# EasyEDA schematic CircuitDiagramSheet.json
TITLE: Cool Macro Keyboard; REV: 1.0; Date: 2023-12-19; Sheet: 1/1; Drawn By: Ben Zhou; Company: Idk
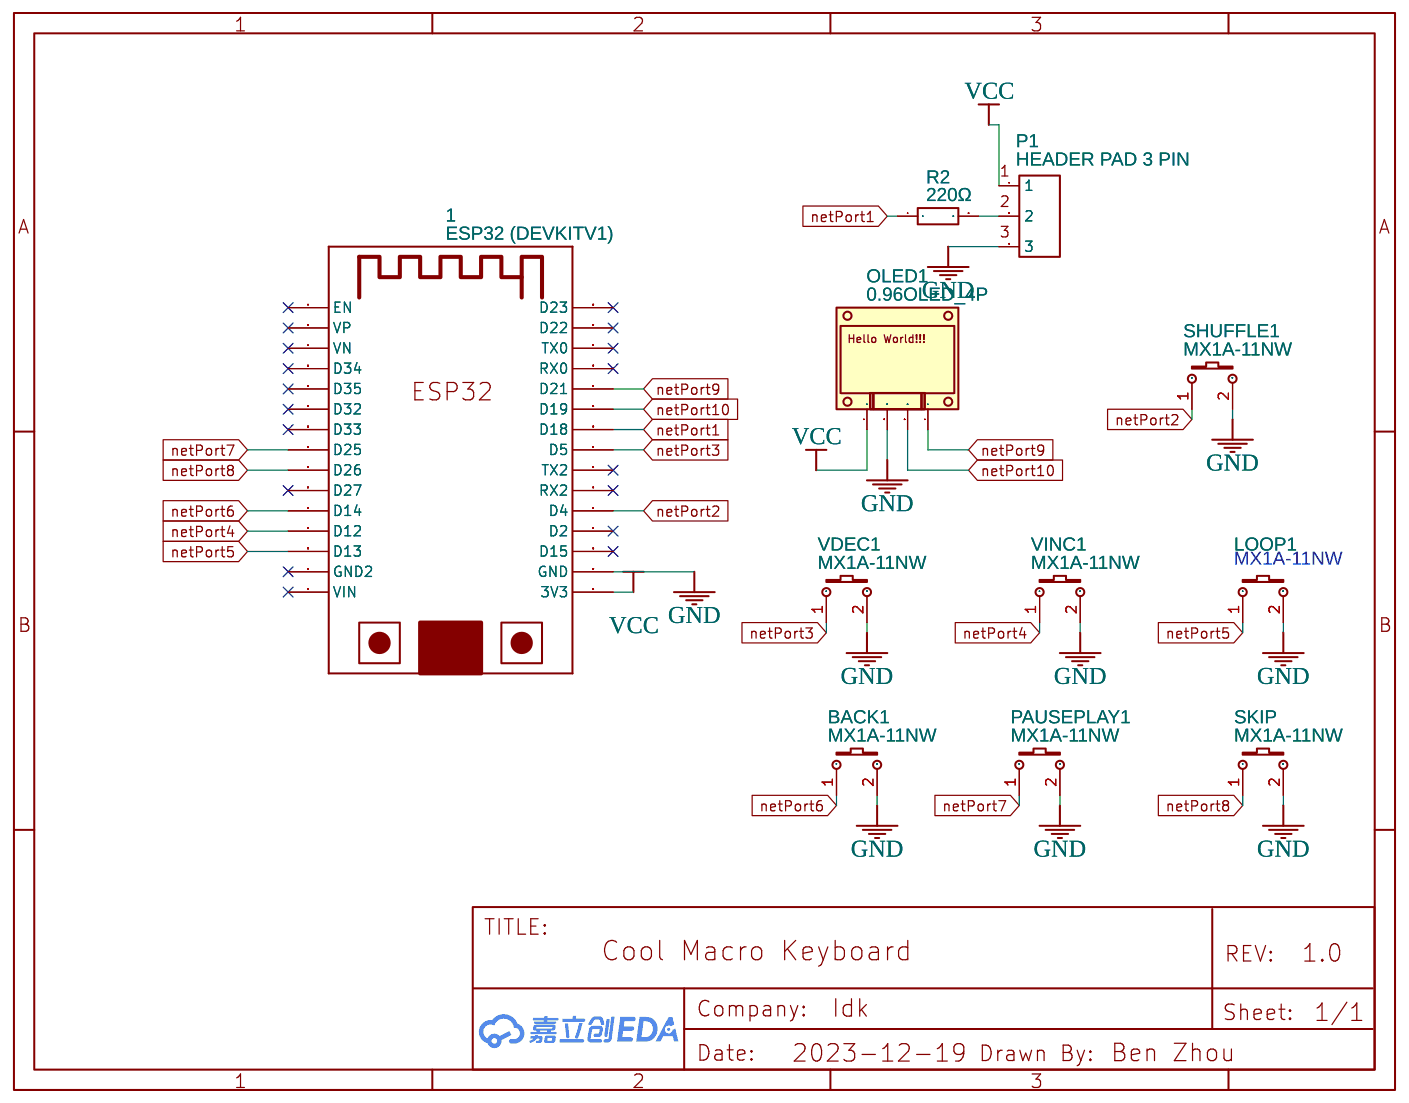
[diagram p0: schematic sheet]

## Parts
1  ESP32 (DEVKITV1)  [ESP32-DEVKITV1_ESP32-DEVKITV1]
BACK1  MX1A-11NW  [SW-TH_MX1A-11NW]
LOOP1  SW4  [SW-TH_MX1A-11NW]
OLED1  0.96OLED_4P  [0.96OLED_4P]
P1  HEADER PAD 3 PIN  [CONNECTOR_PINHEADER_2.54MM:PINHEADER_1X3]
PAUSEPLAY1  MX1A-11NW  [SW-TH_MX1A-11NW]
R2  220Ω  [RES-TH_BD3.5-L9.0-P13.00-D0.8]
SHUFFLE1  MX1A-11NW  [SW-TH_MX1A-11NW]
SKIP  MX1A-11NW  [SW-TH_MX1A-11NW]
VDEC1  MX1A-11NW  [SW-TH_MX1A-11NW]
VINC1  MX1A-11NW  [SW-TH_MX1A-11NW]

## Library data of the parts
1 = ESP32-DEVKIT-V1-30PIN: Contributor: Leonardo Oliveira
BACK1 LOOP1 PAUSEPLAY1 SHUFFLE1 SKIP VDEC1 VINC1 = MX1A-11NW: Supplier: LCSC; Supplier Part: C3316924; Manufacturer: CHERRY; Contributor: lcsc
OLED1 = 0.96OLED_4P: Supplier: LCSC; Contributor: LCEDA_Lib
P1 = HEADER PAD 3 PIN: Supplier: LCSC; Manufacturer: BOOMELE; Supplier Part: C27438; JLCPCB Part Class: Extended Part; Contributor: vincentboisselier
R2 = RSS02J2200A520NH: Contributor: LCSC; Supplier: LCSC; Supplier Part: C274842; Manufacturer: 台湾双羽; JLCPCB Part Class: Extended Part

## Nets
GND: 1.GND BACK1.2 LOOP1.2 OLED1.2 P1.3 PAUSEPLAY1.2 SHUFFLE1.2 SKIP.2 VDEC1.2 VINC1.2
VCC: 1.3V3 OLED1.1 P1.1
netPort1: 1.D18 R2.1
netPort2: 1.D4 SHUFFLE1.1
netPort3: 1.D5 VDEC1.1
netPort4: 1.D12 VINC1.1
netPort5: 1.D13 LOOP1.1
netPort6: 1.D14 BACK1.1
netPort7: 1.D25 PAUSEPLAY1.1
netPort8: 1.D26 SKIP.1
netPort9: 1.D21 OLED1.4
netPort10: 1.D19 OLED1.3
Net-(P1-2): P1.2 R2.2

Not connected (* = marked no-connect by the designer): 1 D2* D15* D22* D23* D27* D32* D33* D34* D35* EN* GND2* RX0* RX2* TX0* TX2* VIN* VN* VP*

## Notes on the sheet
- MX1A-11NW
